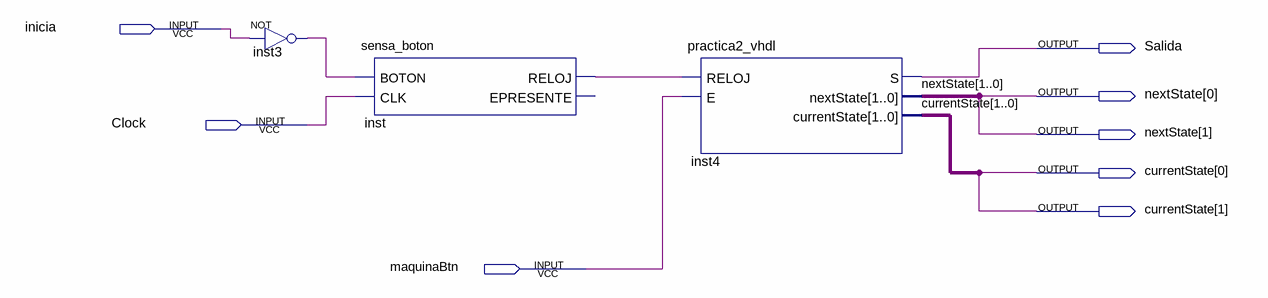
[diagram p0: schematic sheet]
// Quartus schematic Block3.bdf as structural Verilog: 3 symbols, 8 pins
module Block3 (
  input  inicia,
  input  Clock,
  input  maquinaBtn,
  output Salida,
  output [1:0] nextState,
  output [1:0] currentState
);

  wire inst3_out, inst_reloj;

  not inst3 (inst3_out, inicia);
  sensa_boton inst (.BOTON(inst3_out), .CLK(Clock), .RELOJ(inst_reloj));  // open: EPRESENTE
  practica2_vhdl inst4 (
    .RELOJ(inst_reloj), .E(maquinaBtn), .S(Salida), .nextState(nextState), .currentState(currentState));
endmodule
